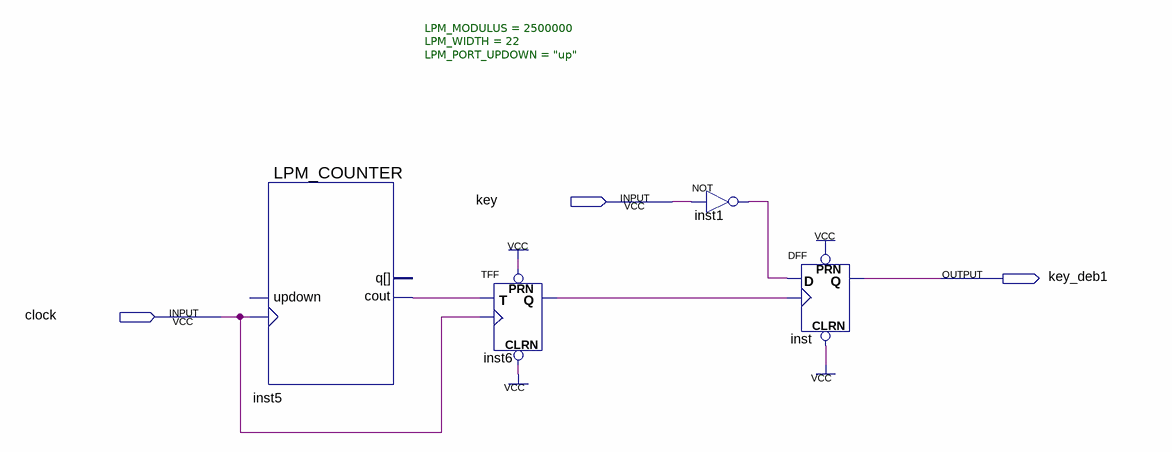
[diagram p0: schematic sheet]
// Quartus schematic key_deb.bdf as structural Verilog: 4 symbols, 3 pins
module key_deb (
  input  key,
  input  clock,
  output key_deb1
);

  wire inst1_out, inst5_cout, inst6_q;

  LPM_COUNTER #(.LPM_MODULUS(2500000), .LPM_WIDTH(22), .LPM_PORT_UPDOWN("up")) inst5 (
    .clock(clock), .cout(inst5_cout));  // open: updown, q
  TFF inst6 (.PRN(1'b1), .CLRN(1'b1), .T(inst5_cout), .CLK(clock), .Q(inst6_q));
  not inst1 (inst1_out, key);
  DFF inst (.CLRN(1'b1), .CLK(inst6_q), .D(inst1_out), .PRN(1'b1), .Q(key_deb1));
endmodule
